# EAGLE design ftdi_opto_single (EAGLE 5.11)
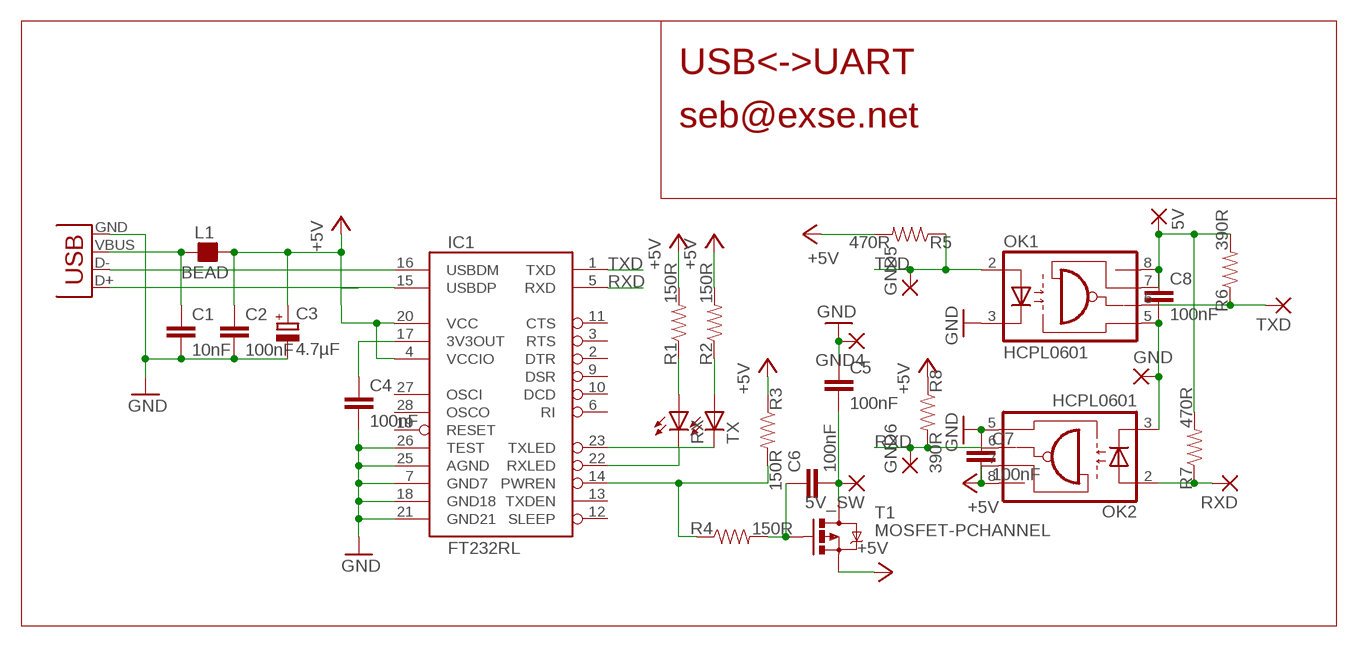
[diagram p0: schematic, sheet 1]

## Parts
5V  SMD2  [SMD1,27-2,54]
5V_SW  SMD2  [SMD1,27-2,54]
C1  10nF  CAP0805  [0805]
C2  100nF  CAP0805  [0805]
C3  4.7µF  CPOL-EUSMCC  [SMC_C]
C4  100nF  CAP0805  [0805]
C5  100nF  CAP0805  [0805]
C6  100nF  CAP0805  [0805]
C7  100nF  CAP0805  [0805]
C8  100nF  CAP0805  [0805]
GND  SMD2  [SMD1,27-2,54]
GND4  SMD2  [SMD1,27-2,54]
GND5  SMD2  [SMD1,27-2,54]
GND6  SMD2  [SMD1,27-2,54]
IC1  FT232RL  FT232RLSSOP  [SSOP28DB]
L1  BEAD  FB_0805  [L0805]
OK1  HCPL0601  [SOIC08]
OK2  HCPL0601  [SOIC08]
R1  150R  RESISTOR  [0805]
R2  150R  RESISTOR  [0805]
R3  150R  RESISTOR  [0805]
R4  150R  RESISTOR  [0805]
R5  470R  RESISTOR  [0805]
R6  390R  RESISTOR  [0805]
R7  470R  RESISTOR  [0805]
R8  390R  RESISTOR  [0805]
RX  LEDCHIP-LED0805  [CHIP-LED0805]
RXD  SMD2  [SMD1,27-2,54]
T1  MOSFET-PCHANNEL  [SOT23]
TX  LEDCHIP-LED0805  [CHIP-LED0805]
TXD  SMD2  [SMD1,27-2,54]
X1  USB-SMD-NS  [USB-MINIB-NOSTOP]

## Nets
5V_SW: 5V_SW.1(P) C5.2 C6.2 T1.3(D)
+5V: C2.1 C3.+ C7.2 IC1.4(VCCIO) IC1.20(VCC) L1.2 OK2.7(VE) OK2.8(VCC) R1.2 R2.2 R3.1 R5.2 R8.1 T1.2(S)
GND: C1.2 C2.2 C3.- C4.2 C5.1 C7.1 GND4.1(P) IC1.7(GND7) IC1.18(GND18) IC1.21(GND21) IC1.25(AGND) IC1.26(TEST) OK1.3(C) OK2.5(GND) X1.GND
N$1: IC1.16(USBDM) X1.D-
N$2: IC1.15(USBDP) X1.D+
N$4: C1.1 L1.1 X1.VBUS
N$5: IC1.14(PWREN) R3.2 R4.1
N$7: C6.1 R4.2 T1.1(G)
N$8: C8.2 GND.1(P) OK1.5(GND) OK2.3(C)
N$9: 5V.1(P) C8.1 OK1.7(VE) OK1.8(VCC) R6.2 R7.2
N$10: OK1.6(VO) R6.1 TXD.1(P)
N$11: OK2.2(A) R7.1 RXD.1(P)
N$19: R1.1 RX.A
N$20: R2.1 TX.A
N$27: IC1.22(RXLED) RX.C
N$28: IC1.23(TXLED) TX.C
N$29: C4.1 IC1.17(3V3OUT)
RXD: GND6.1(P) IC1.5(RXD) OK2.6(VO) R8.2
TXD: GND5.1(P) IC1.1(TXD) OK1.2(A) R5.1
Unconnected: IC1.2(DTR) IC1.3(RTS) IC1.6(RI) IC1.9(DSR) IC1.10(DCD) IC1.11(CTS) IC1.12(SLEEP) IC1.13(TXDEN) IC1.19(RESET) IC1.27(OSCI) IC1.28(OSCO)

## Notes on the sheet
- USB<->UART
- seb@exse.net

## Library data of the parts
5V 5V_SW GND GND4-GND6 RXD TXD = wirepad:SMD2: SMD PAD
C1 C2 C4-C8 = SparkFun:CAP: Capacitor Standard 0603 ceramic capacitor, and 0.1" leaded capacitor.
C3 = resistor:CPOL-EU: POLARIZED CAPACITOR, European symbol
IC1 = SparkFun:FT232RL: USB UART FT232RL 4th Generation USB UART (USB <-> Serial) Controller. Spark Fun Electronics SKU : COM-00650
L1 = rc-master-smd:FB_: FERRITE BEAD
OK1 OK2 = optocoupler:HCPL0601: HEWLETT PACKARD OPTO COUPLER; MF: AGILENT TECHNOLOGIES; MPN: HCPL-0601-000E; OC_FARNELL: 9995102; OC_NEWARK: 88H7776
R1-R8 = SparkFun:RESISTOR: Resistor Basic schematic elements and footprints for 0603, 1206, and PTH 1/10th watt (small) resistors.
RX TX = led:LED: LED OSRAM: - CHIPLED LG R971, LG N971, LY N971, LG Q971, LY Q971, LO R971, LY R971 LH N974, LH R974 LS Q976, LO Q976, LY Q976 LO Q996 - Hyper CHIPLED LW Q18S LB Q993, LB Q99A, LB R99A - SideLED LS A670, LO A670, LY A670, LG A670, LP A670 LB A673, LV A673, LT A673, LW A673 LH A674 LY A675 LS A676, LA A676, LO A676, LY A676, LW A676 LS A679, LY A679, LG A679 - Hyper Micro SIDELED® LS Y876, LA Y876, LO Y876, LY Y876 LT Y87S - SmartLED LW L88C, LW L88S LB L89C, LB L89S, LG L890 LS L89K, LO L89K, LY L89K LS L896, LA L896, LO L896, LY L896 - TOPLED LS T670, LO T670, LY T670, LG T670, LP T670 LSG T670, LSP T670, LSY T670, LOP T670, LYG T670 LG T671, LOG T671, LSG T671 LB T673, LV T673, LT T673, LW T673 LH T674 LS T676, LA T676, LO T676, LY T676, LB T676, LH T676, LSB T676, LW T676 LB T67C, LV T67C, LT T67C, LS T67K, LO T67K, LY T67K, LW E67C LS E67B, LA E67B, LO E67B, LY E67B, LB E67C, LV E67C, LT E67C LW T67C LS T679, LY T679, LG T679 LS T770, LO T770, LY T770, LG T770, LP T770 LB T773, LV T773, LT T773, LW T773 LH T774 LS E675, LA E675, LY E675, LS T675 LS T776, LA T776, LO T776, LY T776, LB T776 LHGB T686 LT T68C, LB T68C - Hyper Mini TOPLED® LB M676 - Mini TOPLED Santana® LG M470 LS M47K, LO M47K, LY M47K Source: http://www.osram.convergy.de LUXEON: - LUMILED® LXK2-PW12-R00, LXK2-PW12-S00, LXK2-PW14-U00, LXK2-PW14-V00 LXK2-PM12-R00, LXK2-PM12-S00, LXK2-PM14-U00 LXK2-PE12-Q00, LXK2-PE12-R00, LXK2-PE12-S00, LXK2-PE14-T00, LXK2-PE14-U00 LXK2-PB12-K00, LXK2-PB12-L00, LXK2-PB12-M00, LXK2-PB14-N00, LXK2-PB14-P00, LXK2-PB14-Q00 LXK2-PR12-L00, LXK2-PR12-M00, LXK2-PR14-Q00, LXK2-PR14-R00 LXK2-PD12-Q00, LXK2-PD12-R00, LXK2-PD12-S00 LXK2-PH12-R00, LXK2-PH12-S00 LXK2-PL12-P00, LXK2-PL12-Q00, LXK2-PL12-R00 Source: www.luxeon.com KINGBRIGHT: KA-3528ASYC Source: www.kingbright.com
T1 = SparkFun:MOSFET-PCHANNEL
X1 = SparkFun:USB: USB Connectors USB-B-PTH is fully proven SKU : PRT-00139 USB-miniB is fully proven SKU : PRT-00587 USB-A-PCB is untested. USB-A-H is throughly reviewed, but untested. Spark Fun Electronics SKU : PRT-00437 USB-B-SMT is throughly reviewed, but untested. Needs silkscreen touching up. USB-A-S has not been used/tested USB-MB-H has not been used/tested

## Board
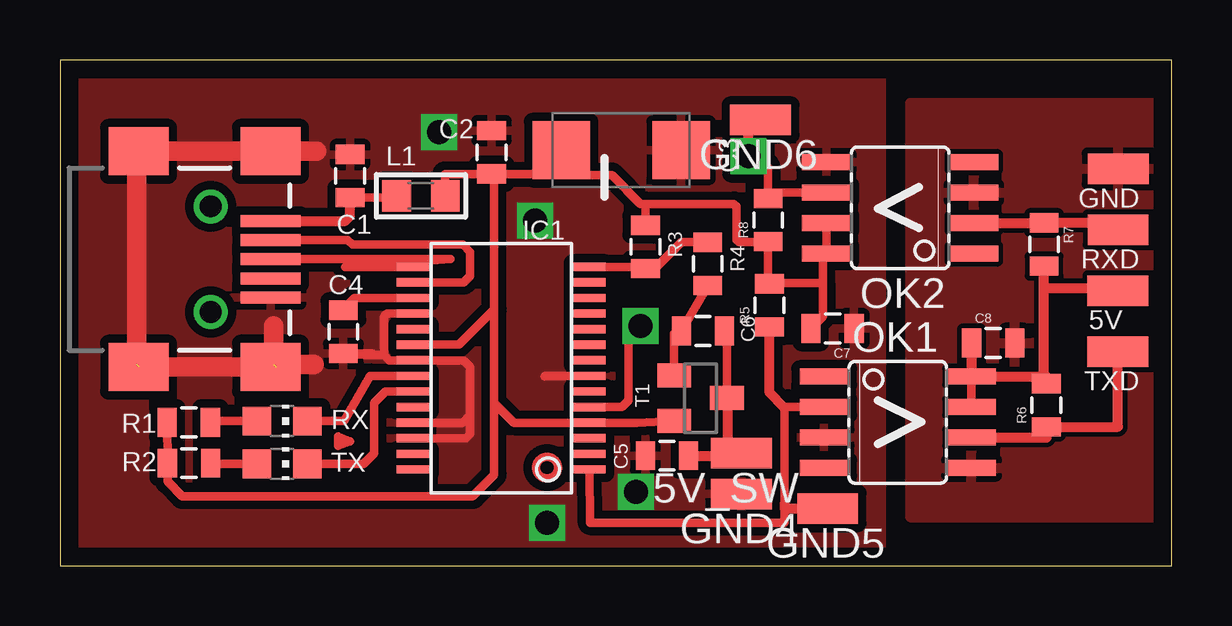
[diagram p1: board, top side]
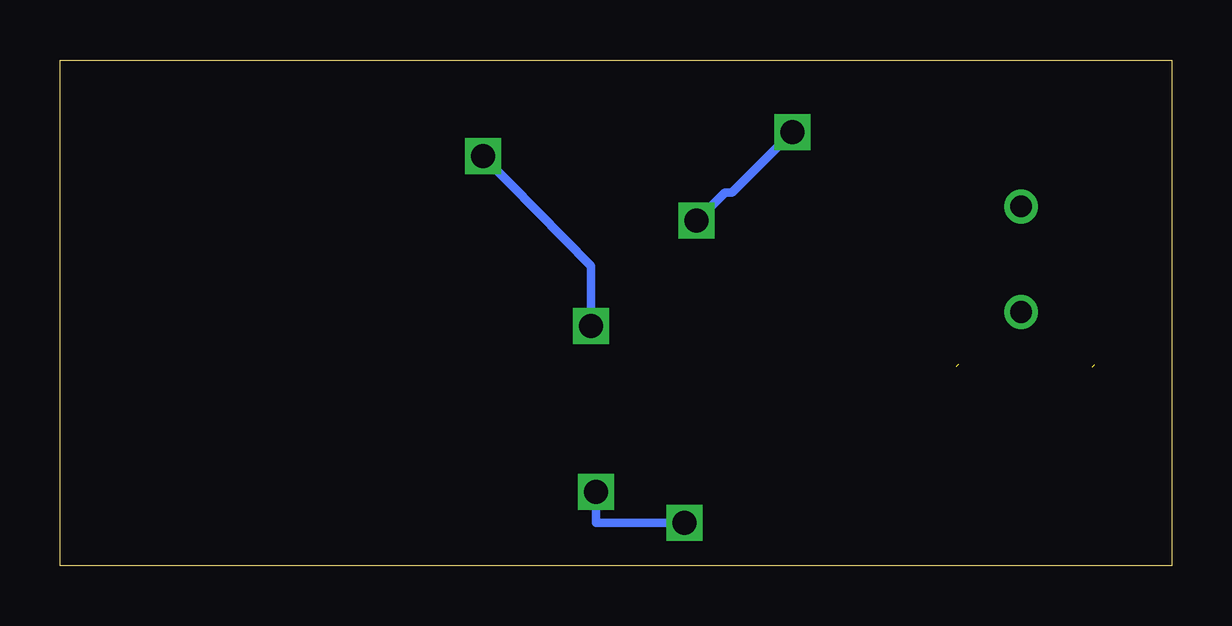
[diagram p2: board, bottom side, seen from below]

Size 46.34 x 21.1 mm. Coordinates in mm from the lower left corner, seen from the top.
Outline: 0,0 46.34,0 46.34,21.1 0,21.1 0,0
Copper layers (1*16): Top 0.035mm / dielectric 1.5mm / Bottom 0.035mm
Design rules "default *": minimum track width 10mil, minimum drill 0.3mm, track to track 8mil, track to pad 8mil, pad to pad 8mil, via to via 8mil, smd to smd 8mil, copper to edge 30mil, drill to drill 8mil, minimum pad ring 10mil, minimum via ring 8mil, stop-mask expansion 4mil, vias tented up to drill 50mil, thermal gap 10mil
tRestrict: 1 lines

### Footprints (pad centres in the part's own frame; a part is rotated, then mirrored left to right if it is on the bottom)
SMD1,27-2,54 = smd 1.27 x 2.54: 1 0,0
0805 = smd 0.8 x 1.2: 1 -0.9,0; 2 0.9,0
SMC_C = smd 2.4 x 2.4: + -2.5,0; - 2.5,0
SSOP28DB = smd 0.348 x 1.397: 1 -4.225,-3.656; 2 -3.575,-3.656; 3 -2.925,-3.656; 4 -2.275,-3.656; 5 -1.625,-3.656; 6 -0.975,-3.656; 7 -0.325,-3.656; 8 0.325,-3.656; 9 0.975,-3.656; 10 1.625,-3.656; 11 2.275,-3.656; 12 2.925,-3.656; 13 3.575,-3.656; 14 4.225,-3.656; 15 4.225,3.656; 16 3.575,3.656; 17 2.925,3.656; 18 2.275,3.656; 19 1.625,3.656; 20 0.975,3.656; 21 0.325,3.656; 22 -0.325,3.656; 23 -0.975,3.656; 24 -1.625,3.656; 25 -2.275,3.656; 26 -2.925,3.656; 27 -3.575,3.656; 28 -4.225,3.656
L0805 = smd 1.2 x 1.3: 1 -1.016,0; 2 1.016,0
SOIC08 = smd 0.66 x 2.032: 1 -1.905,-3.073; 2 -0.635,-3.073; 3 0.635,-3.073; 4 1.905,-3.073; 5 1.905,3.073; 6 0.635,3.073; 7 -0.635,3.073; 8 -1.905,3.073
CHIP-LED0805 = smd 1.2 x 1.2: A 0,-1.05; C 0,1.05
SOT23 = smd 1 x 1.4: 1 -0.95,-1.1; 2 0.95,-1.1; 3 0,1.1
USB-MINIB-NOSTOP = smd 2.5 x 0.5: D+ 2.5,0; D- 2.5,0.8; GND 2.5,-1.6; ID 2.5,-0.8; VBUS 2.5,1.6 | smd 2.5 x 2: G1 -3,-4.5; G2 -3,4.5; G3 2.5,4.5; G4 2.5,-4.5 | drill 0.9 pad 0.8 round: H1 0,2.2 | drill 0.9 pad 0.787 round: H2 0,-2.2

### Placement (x,y rotation side)
5V  44.1,11.48 90 top
5V_SW  28.4,4.7 90 top
C1  12.09,16.26 90 top
C2  17.99,17.25 90 top
C3  23.39,17.34 0 top
C4  11.81,9.76 270 top
C5  25.3,4.6 0 top
C6  26.8,9.8 0 top
C7  32.2,9.9 180 top
C8  38.9,9.3 0 top
GND  44.11,16.56 90 top
GND4  28.4,3 90 top
GND5  32,2.4 90 top
GND6  29.2,18.6 90 top
IC1  18.39,8.25 90 top
L1  15.05,15.43 0 top
OK1  34.92,5.99 270 top
OK2  35.02,14.93 90 top
R1  5.37,5.99 180 top
R2  5.38,4.29 180 top
R3  24.4,13.3 270 top
R4  27,12.6 270 top
R5  29.57,10.87 90 top
R6  41.12,6.7 90 top
R7  41.02,13.41 270 top
R8  29.52,14.42 90 top
RX  9.26,6.04 270 top
RXD  44.1,14.02 90 top
T1  26.7,7 270 top
TX  9.26,4.26 270 top
TXD  44.1,8.94 90 top
X1  6.28,12.79 0 top

### Tracks (layer width: path | path; a pad name or v marks a point on that pad's centre or on a via)
5V_SW
  Top 0.35: T1.3 27.8,9.1 C6.2
  Top 0.406: 27.85,4.35 27.6,4.6 C5.2 | 27.85,4.35 5V_SW.1 | T1.3 27.85,6.95 27.85,4.35
+5V
  Top 0.35: IC1.20 16.62,9.23 18.09,10.69 | R1.2 R2.2 4.48,3.52 5.1,2.9 17.2,2.9 18.1,3.8 | 18.1,3.8 18.09,3.81 | C2.1 16.05,16.35 L1.2 | 18.09,10.69 18.09,16.05 C2.1 | T1.2 24.02,5.98 IC1.4 18.93,5.98 18.1,6.8 | 18.1,6.8 18.1,10.68 18.09,10.69 | 18.1,3.8 18.1,6.8 | 31.8,11.8 31.8,12.88 OK2.8 OK2.7 | 31.8,11.8 29.61,11.8 R5.2 29.52,11.77 R8.1 29.5,13.5 28.3,13.5 28.2,13.6 28.2,15 28.1,15.1 24.4,15.1 | 31.8,11.8 31.8,10.4 C7.2 | C3.+ 20.7,17.15 | C2.1 19.9,16.35 C3.+ | 24.4,15.1 24.2,15.1 23,16.3 21.93,16.3 C3.+ | 24.4,15.1 R3.1
  Top 0.406: L1.2 16.07,15.33
GND  (via drill 1)  (2 unrouted)
  Top 0.35: IC1.26 16.93,5.33 17.1,5.5 17.1,6.3 | 17.1,6.3 17.1,8.3 16.82,8.57 IC1.21 13.72,8.57 13.5,8.8 | IC1.25 16.77,5.98 17.1,6.3 | 13.5,8.8 13.5,10.4 13.62,10.52 IC1.18 | 13.5,8.8 12.67,8.8 C4.2 13.04,8.86 | 25.9,17.9 25.89,17.81 C3.- | IC1.7 20.22,7.92 20.2,7.9
  Top 0.813: 3.3,17.3 10.7,17.3 | 3.2,8.4 3.2,17.5 | 3.3,8.3 9,8.3 | 8.9,10 8.9,8.4 10.6,8.4
  Bottom 0.35: v20.3,1.8 24,1.8 v24,3.1 | v15.8,18.1 18.32,15.57 18.62,15.57 v19.8,14.4
  pour Top (isolate 0.35): 0.1,-0.1 34.26,0 34.26,21.4 0,21.2
N$1
  Top 0.35: IC1.16 16.82,11.82 17.1,12.1 17.1,13.1 16.8,13.4 12.2,13.4 11.99,13.59 X1.D-
N$2
  Top 0.35: X1.D+ 16.29,12.79 11.88,12.47 IC1.15
N$3
  Top 0.35: 11.6,5.4 11.6,5 12.1,5.2 11.6,5.4
N$4
  Top 0.35: C1.1 14.06,15.36 L1.1
  Top 0.406: X1.VBUS 11.89,14.39 12.09,14.59 C1.1 | L1.1 14.03,15.33
N$5
  Top 0.35: IC1.14 24.02,12.47 R3.2 24.8,12.4 25.9,13.5 R4.1
N$7
  Top 0.35: T1.1 25.6,9.7 C6.1 R4.2
N$8
  pour Top: 35.43,2.03 49.55,2.03 49.55,19.3 35.43,19.3
N$9
  Top 0.35: OK1.8 OK1.7
  Top 0.406: 41.02,11.6 41.02,7.6 R6.2 41.12,7.9 OK1.8 | 41.02,11.6 R7.2 | 5V.1 44.1,11.6 41.02,11.6 | OK1.8 C8.1
N$10
  Top 0.406: OK1.6 41.12,5.36 R6.1 44.1,5.8 TXD.1
N$11
  Top 0.406: OK2.2 41.02,14.3 R7.1 44.1,14.31 RXD.1
N$19
  Top 0.35: R1.1 6.42,6.04 RX.A
N$20
  Top 0.35: R2.1 6.41,4.26 TX.A
N$27
  Top 0.35: RX.C 11.84,6.04 12.92,7.92 IC1.22
N$28
  Top 0.35: IC1.23 13.57,7.27 13.1,6.8 13.1,4.7 12.66,4.26 TX.C
N$29
  Top 0.35: C4.1 11.76,10.66 12.27,11.18 IC1.17
RXD  (via drill 1)
  Top 0.35: OK2.6 29.52,15.57 R8.2 29.52,16.62 29.4,16.8 29.1,17.1 v28.7,17.1 | IC1.5 23.43,6.63 23.7,6.9 23.7,10 v24.2,10
  Top 0.406: GND6.1 28.7,18.7 v28.7,17.1
  Bottom 0.35: v24.2,10 24.2,12.5 v28.7,17.1
TXD
  Top 0.35: IC1.1 22.07,4.02 22.1,1.8 30.2,1.8 30.2,2.3 30.2,2.6 30.2,6.6 30.23,6.63 OK1.2 | R5.1 29.6,9.77
  Top 0.406: 30.2,6.6 29.57,7.23 R5.1 | GND5.1 30.2,2.4 30.2,2.6
(copper drawn outside any net)
  shapes: Top circle x1

### Text on the board
bStop: GND | seb@exse.net | RX | TX | 5V | UART <-> USB